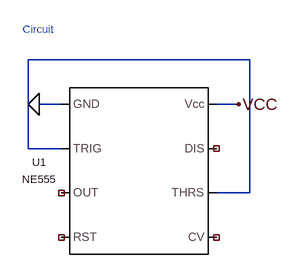
[diagram p0: schematic circuit.asc]
circuit.asc, the LTspice schematic file:
Version 4
SHEET 1 432 416
SYMBOL Misc\NE555 448 336 R0
WINDOW 0 -144 -12 Center 1
WINDOW 3 -144 12 Center 1
SYMATTR InstName U1
SYMATTR Value NE555
WIRE 288 176 288 304
WIRE 288 176 608 176
WIRE 288 304 336 304
WIRE 304 240 336 240
WIRE 560 240 592 240
WIRE 560 368 608 368
WIRE 608 176 608 368
FLAG 304 240 0
FLAG 592 240 VCC
TEXT 280 132 Left 1 ;Circuit

The netlist it stands for:
* circuit.asc
XU1 0 N001 NC_01 NC_02 NC_03 N001 NC_04 VCC NE555  ; pins GND TRIG OUT RST CV THRS DIS Vcc
* Circuit
.lib NE555.sub
.backanno
.end